# EasyEDA Pro project LogicBoardFPGAEP6.eprj

# Schematic Schematic1
Create Date: 2024-01-02; Page Name: P1; Project Name: LogicBoardFPGAEP6; Schematic Name: Schematic1; Update Date: 2024-01-02; Company: EasyEDA.com; Drawed: EasyEDA Pro; Page Size: A4; Part Number: JLCPCB-002; Reviewed: EasyEDA Pro; Version: V0.1
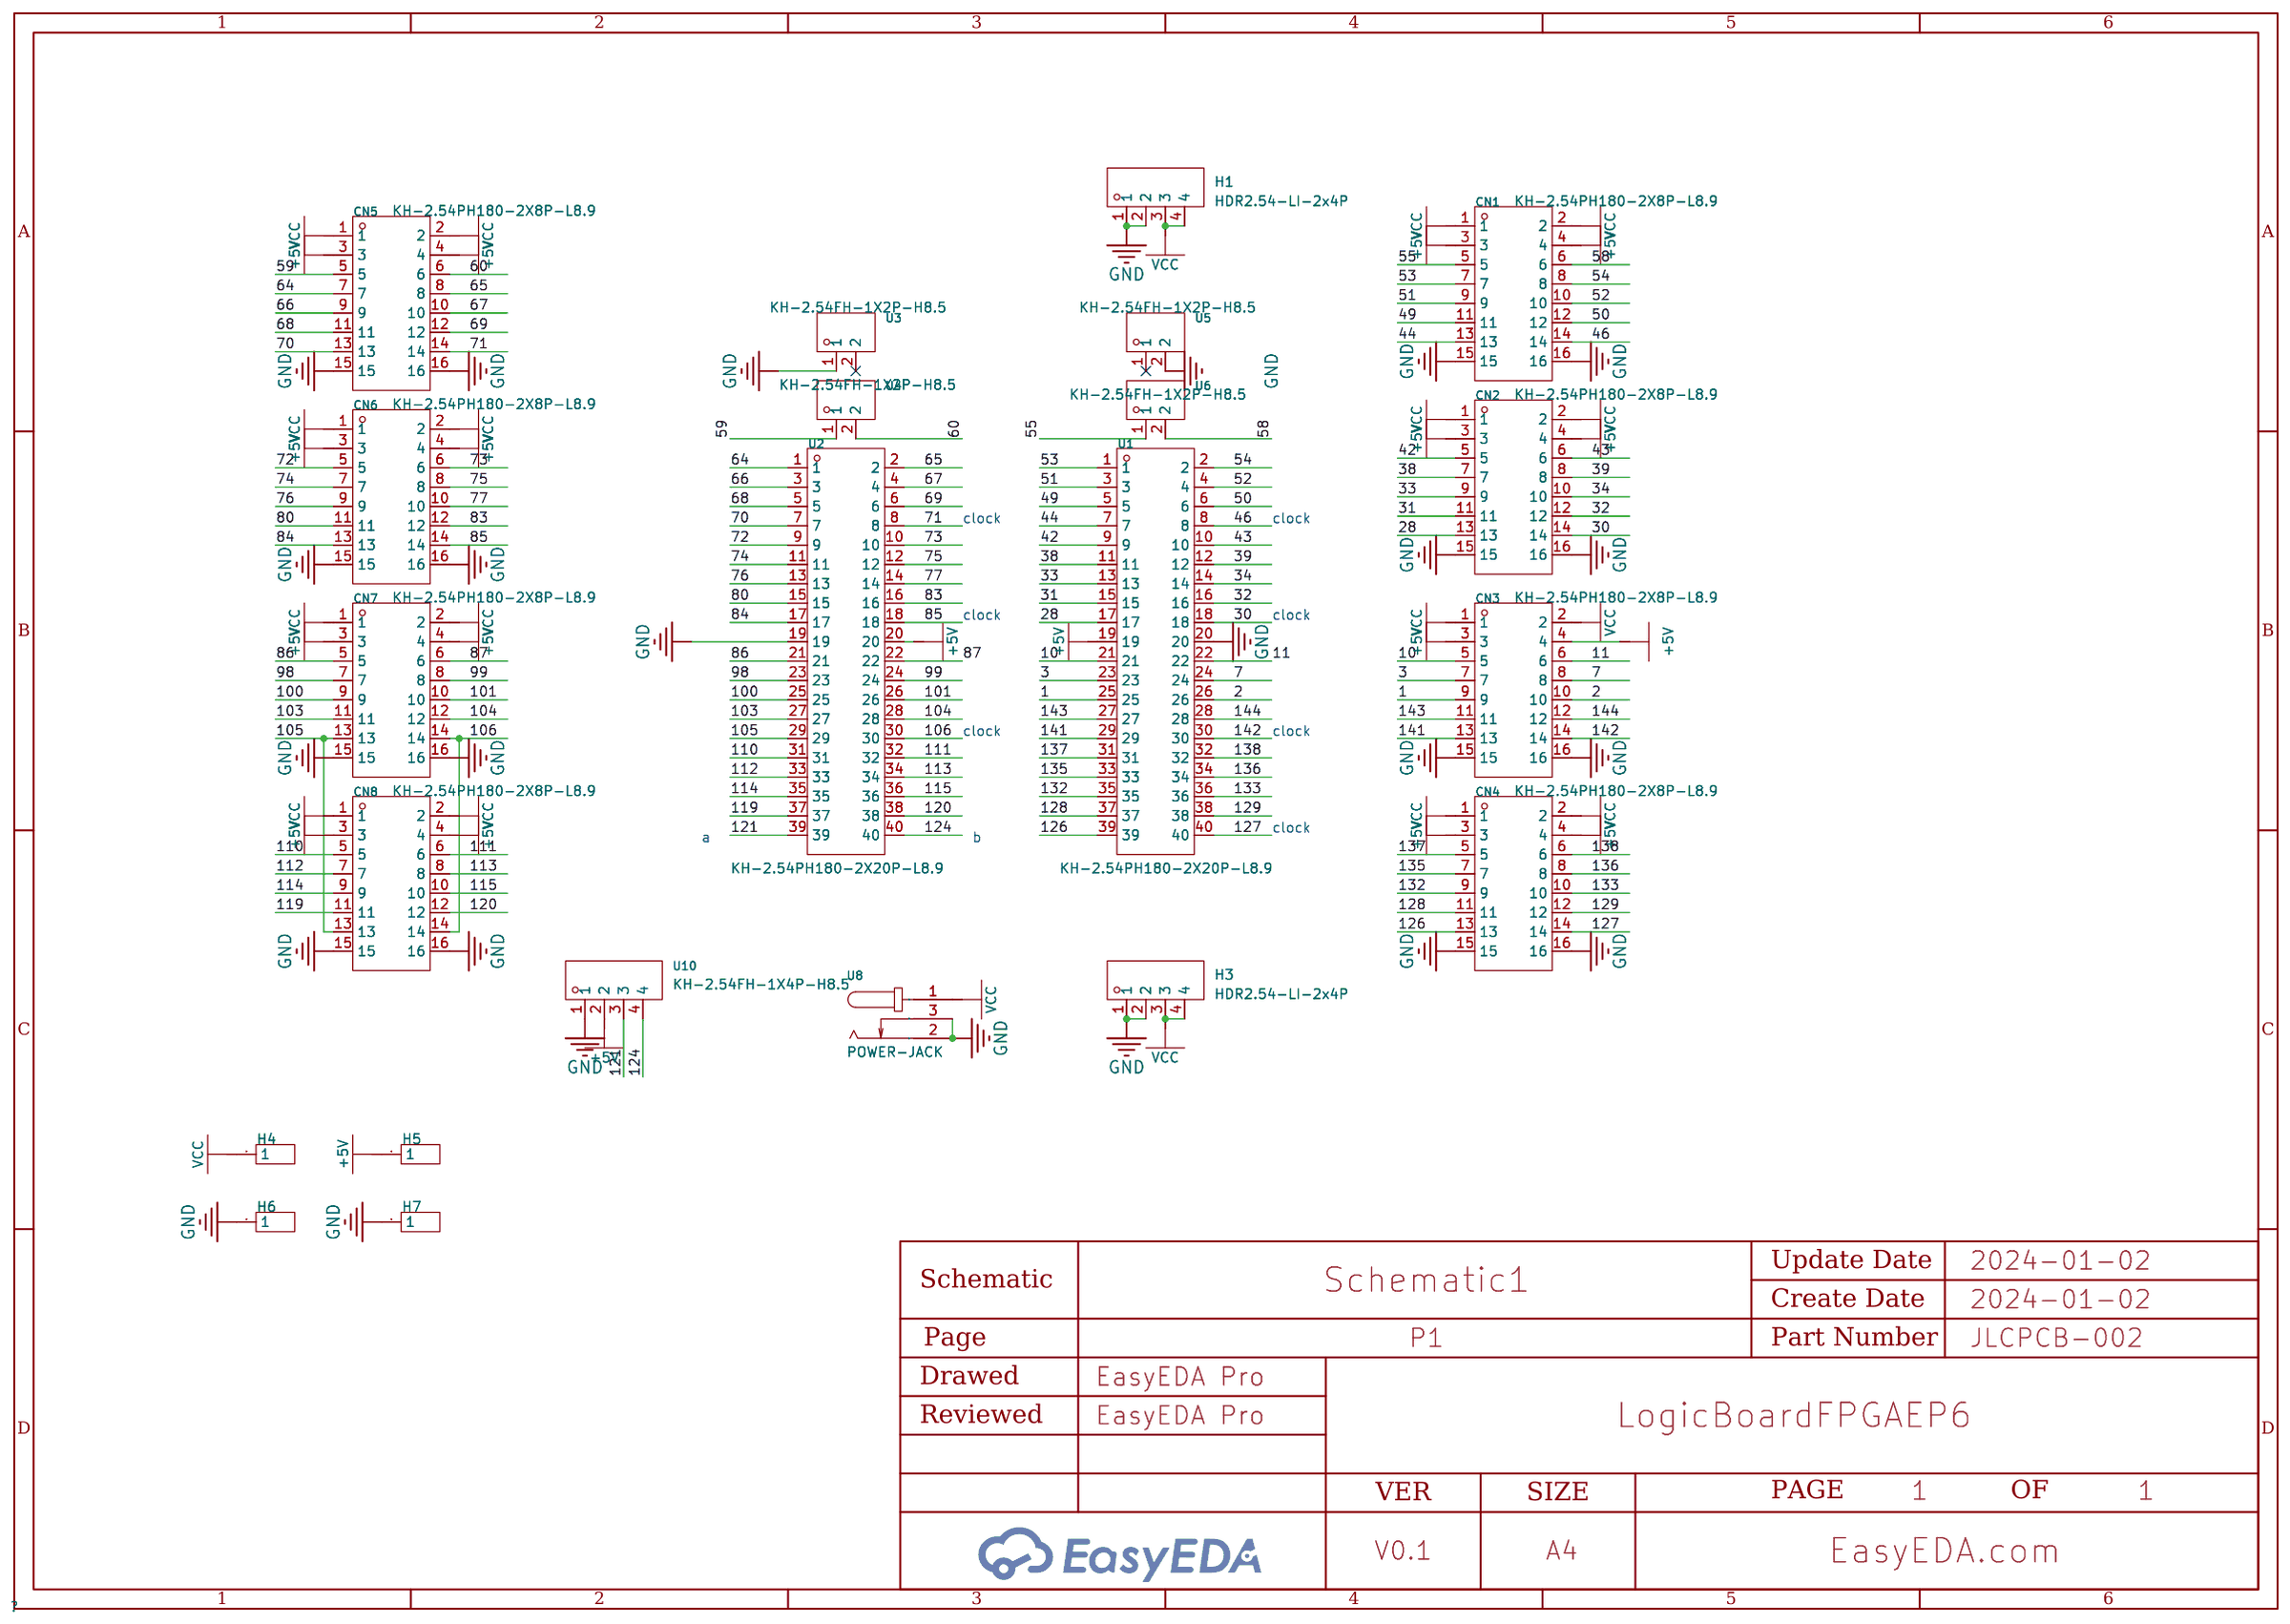
[diagram p0: schematic sheet]

## Parts
CN1  KH-2.54PH180-2X8P-L8.9  [CONN-TH_16P-P2.54_KINGHELM_KH-2.54PH180-2X8P-L8.9]
CN2  KH-2.54PH180-2X8P-L8.9  [CONN-TH_16P-P2.54_KINGHELM_KH-2.54PH180-2X8P-L8.9]
CN3  KH-2.54PH180-2X8P-L8.9  [CONN-TH_16P-P2.54_KINGHELM_KH-2.54PH180-2X8P-L8.9]
CN4  KH-2.54PH180-2X8P-L8.9  [CONN-TH_16P-P2.54_KINGHELM_KH-2.54PH180-2X8P-L8.9]
CN5  KH-2.54PH180-2X8P-L8.9  [CONN-TH_16P-P2.54_KINGHELM_KH-2.54PH180-2X8P-L8.9]
CN6  KH-2.54PH180-2X8P-L8.9  [CONN-TH_16P-P2.54_KINGHELM_KH-2.54PH180-2X8P-L8.9]
CN7  KH-2.54PH180-2X8P-L8.9  [CONN-TH_16P-P2.54_KINGHELM_KH-2.54PH180-2X8P-L8.9]
CN8  KH-2.54PH180-2X8P-L8.9  [CONN-TH_16P-P2.54_KINGHELM_KH-2.54PH180-2X8P-L8.9]
H1  HDR2.54-LI-2x4P  [HDR-TH_4P-P2.54-V-M]
H3  HDR2.54-LI-2x4P  [HDR-TH_4P-P2.54-V-M]
H4  -  [HDR-TH_1P-V-M_XKB_X4611WV-01I-C28D40]
H5  -  [HDR-TH_1P-V-M_XKB_X4611WV-01I-C28D40]
H6  -  [HDR-TH_1P-V-M_XKB_X4611WV-01I-C28D40]
H7  -  [HDR-TH_1P-V-M_XKB_X4611WV-01I-C28D40]
U1  KH-2.54PH180-2X20P-L8.9  [CONN-TH_40P-P2.54_KINGHELM_KH-2.54PH180-2X20P-L8.9]
U2  KH-2.54PH180-2X20P-L8.9  [CONN-TH_40P-P2.54_KINGHELM_KH-2.54PH180-2X20P-L8.9]
U3  KH-2.54FH-1X2P-H8.5  [HDR-TH_2P-P2.54-V-F]
U4  KH-2.54FH-1X2P-H8.5  [HDR-TH_2P-P2.54-V-F]
U5  KH-2.54FH-1X2P-H8.5  [HDR-TH_2P-P2.54-V-F]
U6  KH-2.54FH-1X2P-H8.5  [HDR-TH_2P-P2.54-V-F]
U8  POWER-JACK  [DC-IN-TH_POWER-JACK]
U10  KH-2.54FH-1X4P-H8.5  [HDR-TH_4P-P2.54-V-F]

## Library data of the parts
CN1-CN8 = KH-2.54PH180-2X8P-L8.9: Connector Type:简牛座 Pitch:2.54mm Structure:2x8P Holder Type:Straight Number of Rows:2 Pin Number in each Row:8; LCSC Part Name: 2.54mm 2x8P 排数:2 每排P数:8; Supplier Part: C5157631; Manufacturer: kinghelm(金航标); Supplier Footprint: 插件,P=2.54mm; JLCPCB Part Class: Extended Part; Datasheet: https://atta.szlcsc.com/upload/public/pdf/source/20220902/BDDF6E62C6922AC108506376901906B3.pdf; Supplier: LCSC; Connector Type: 简牛座; Pitch: 2.54mm; Structure: 2x8P; Holder Type: Straight; Number of Rows: 2; Pin Number in each Row: 8
H1 H3 = HDR2.54-LI-2x4P: Supplier Part: C9900020145; JLCPCB Part Class: Extended Part; Supplier: LCSC
H4-H7 = HDR-M_2.54_1x1P: Supplier Footprint: Through
U1 U2 = KH-2.54PH180-2X20P-L8.9: Connector Type:简牛座 Pitch:2.54mm Structure:2x20P Holder Type:Straight Number of Rows:2 Pin Number in each Row:20; LCSC Part Name: 2.54mm 2x20P 排数:2 每排P数:20; Supplier Part: C5157643; Manufacturer: kinghelm(金航标); Supplier Footprint: 插件,P=2.54mm; JLCPCB Part Class: Extended Part; Datasheet: https://atta.szlcsc.com/upload/public/pdf/source/20220902/9F5B5BEF0E6023DA0EFD6D40BEFA82D8.pdf; Supplier: LCSC; Connector Type: 简牛座; Pitch: 2.54mm; Structure: 2x20P; Holder Type: Straight; Number of Rows: 2; Pin Number in each Row: 20
U3-U6 = KH-2.54FH-1X2P-H8.5: Holes Structure:1x2P Pitch:2.54mm Number of Holes:2P Mounting Type:Straight Number of Rows:Plugin Row Spacing:- Circular Hole / Square Hole:Square Holes Current Rating (Max):3A Voltage Rating (Max):- Holes Direction:Top Insulation Height:8.5mm Operating T; LCSC Part Name: 间距:2.54mm 1x2P 直插; Supplier Part: C2905414; Manufacturer: kinghelm(金航标); Supplier Footprint: 插件,P=2.54mm; JLCPCB Part Class: Extended Part; Datasheet: https://atta.szlcsc.com/upload/public/pdf/source/20211019/82C72C7F9B709EC9DF51C3E4488B0388.pdf; Supplier: LCSC; Holes Structure: 1x2P; Pitch: 2.54mm; Number of Holes: 2P; Mounting Type: Straight; Number of Rows: Plugin; Circular Hole / Square Hole: Square Holes; Current Rating (Max): 3A; Holes Direction: Top; Insulation Height: 8.5mm; Operating Temperature Range: -40℃~+105℃
U8 = POWER-JACK: Supplier Part: C9900001795; JLCPCB Part Class: Extended Part; Supplier: LCSC
U10 = KH-2.54FH-1X4P-H8.5: Holes Structure:1x4P Pitch:2.54mm Number of Holes:4P Mounting Type:Straight Number of Rows:Plugin Row Spacing:- Circular Hole / Square Hole:Square Holes Current Rating (Max):3A Voltage Rating (Max):- Holes Direction:Top Insulation Height:8.5mm Operating T; LCSC Part Name: 间距:2.54mm 1x4P 直插; Supplier Part: C2905415; Manufacturer: kinghelm(金航标); Supplier Footprint: 插件,P=2.54mm; JLCPCB Part Class: Extended Part; Datasheet: https://atta.szlcsc.com/upload/public/pdf/source/20211019/F01742C8B89DCA4810A857CC894DA6D1.pdf; Supplier: LCSC; Holes Structure: 1x4P; Pitch: 2.54mm; Number of Holes: 4P; Mounting Type: Straight; Number of Rows: Plugin; Circular Hole / Square Hole: Square Holes; Current Rating (Max): 3A; Holes Direction: Top; Insulation Height: 8.5mm; Operating Temperature Range: -40℃~+105℃

## Nets
+5V: CN1.3 CN1.4 CN2.3 CN2.4 CN3.3 CN3.4 CN4.3 CN4.4 CN5.3 CN5.4 CN6.3 CN6.4 CN7.3 CN7.4 CN8.3 CN8.4 H5.1 U1.19 U2.20 U10.2
GND: CN1.15 CN1.16 CN2.15 CN2.16 CN3.15 CN3.16 CN4.15 CN4.16 CN5.15 CN5.16 CN6.15 CN6.16 CN7.15 CN7.16 CN8.15 CN8.16 H1.1 H1.2 H3.1 H3.2 H6.1 H7.1 U1.20 U2.19 U3.1 U5.2 U8.2 U8.3 U10.1
VCC: CN1.1 CN1.2 CN2.1 CN2.2 CN3.1 CN3.2 CN4.1 CN4.2 CN5.1 CN5.2 CN6.1 CN6.2 CN7.1 CN7.2 CN8.1 CN8.2 H1.3 H1.4 H3.3 H3.4 H4.1 U8.1
1: CN3.9 U1.25
2: CN3.10 U1.26
3: CN3.7 U1.23
7: CN3.8 U1.24
10: CN3.5 U1.21
11: CN3.6 U1.22
28: CN2.13 U1.17
30: CN2.14 U1.18
31: CN2.11 U1.15
32: CN2.12 U1.16
33: CN2.9 U1.13
34: CN2.10 U1.14
38: CN2.7 U1.11
39: CN2.8 U1.12
42: CN2.5 U1.9
43: CN2.6 U1.10
44: CN1.13 U1.7
46: CN1.14 U1.8
49: CN1.11 U1.5
50: CN1.12 U1.6
51: CN1.9 U1.3
52: CN1.10 U1.4
53: CN1.7 U1.1
54: CN1.8 U1.2
55: CN1.5 U6.1
58: CN1.6 U6.2
59: CN5.5 U4.1
60: CN5.6 U4.2
64: CN5.7 U2.1
65: CN5.8 U2.2
66: CN5.9 U2.3
67: CN5.10 U2.4
68: CN5.11 U2.5
69: CN5.12 U2.6
70: CN5.13 U2.7
71: CN5.14 U2.8
72: CN6.5 U2.9
73: CN6.6 U2.10
74: CN6.7 U2.11
75: CN6.8 U2.12
76: CN6.9 U2.13
77: CN6.10 U2.14
80: CN6.11 U2.15
83: CN6.12 U2.16
84: CN6.13 U2.17
85: CN6.14 U2.18
86: CN7.5 U2.21
87: CN7.6 U2.22
98: CN7.7 U2.23
99: CN7.8 U2.24
100: CN7.9 U2.25
101: CN7.10 U2.26
103: CN7.11 U2.27
104: CN7.12 U2.28
105: CN7.13 CN8.13 U2.29
106: CN7.14 CN8.14 U2.30
110: CN8.5 U2.31
111: CN8.6 U2.32
112: CN8.7 U2.33
113: CN8.8 U2.34
114: CN8.9 U2.35
115: CN8.10 U2.36
119: CN8.11 U2.37
120: CN8.12 U2.38
121: U2.39 U10.3
124: U2.40 U10.4
126: CN4.13 U1.39
127: CN4.14 U1.40
128: CN4.11 U1.37
129: CN4.12 U1.38
132: CN4.9 U1.35
133: CN4.10 U1.36
135: CN4.7 U1.33
136: CN4.8 U1.34
137: CN4.5 U1.31
138: CN4.6 U1.32
141: CN3.13 U1.29
142: CN3.14 U1.30
143: CN3.11 U1.27
144: CN3.12 U1.28

Not connected (* = marked no-connect by the designer): U3 2*; U5 1*

## Notes on the sheet
- clock
- clock
- clock
- clock
- clock
- clock
- a
- b
- clock

# Board PCB1
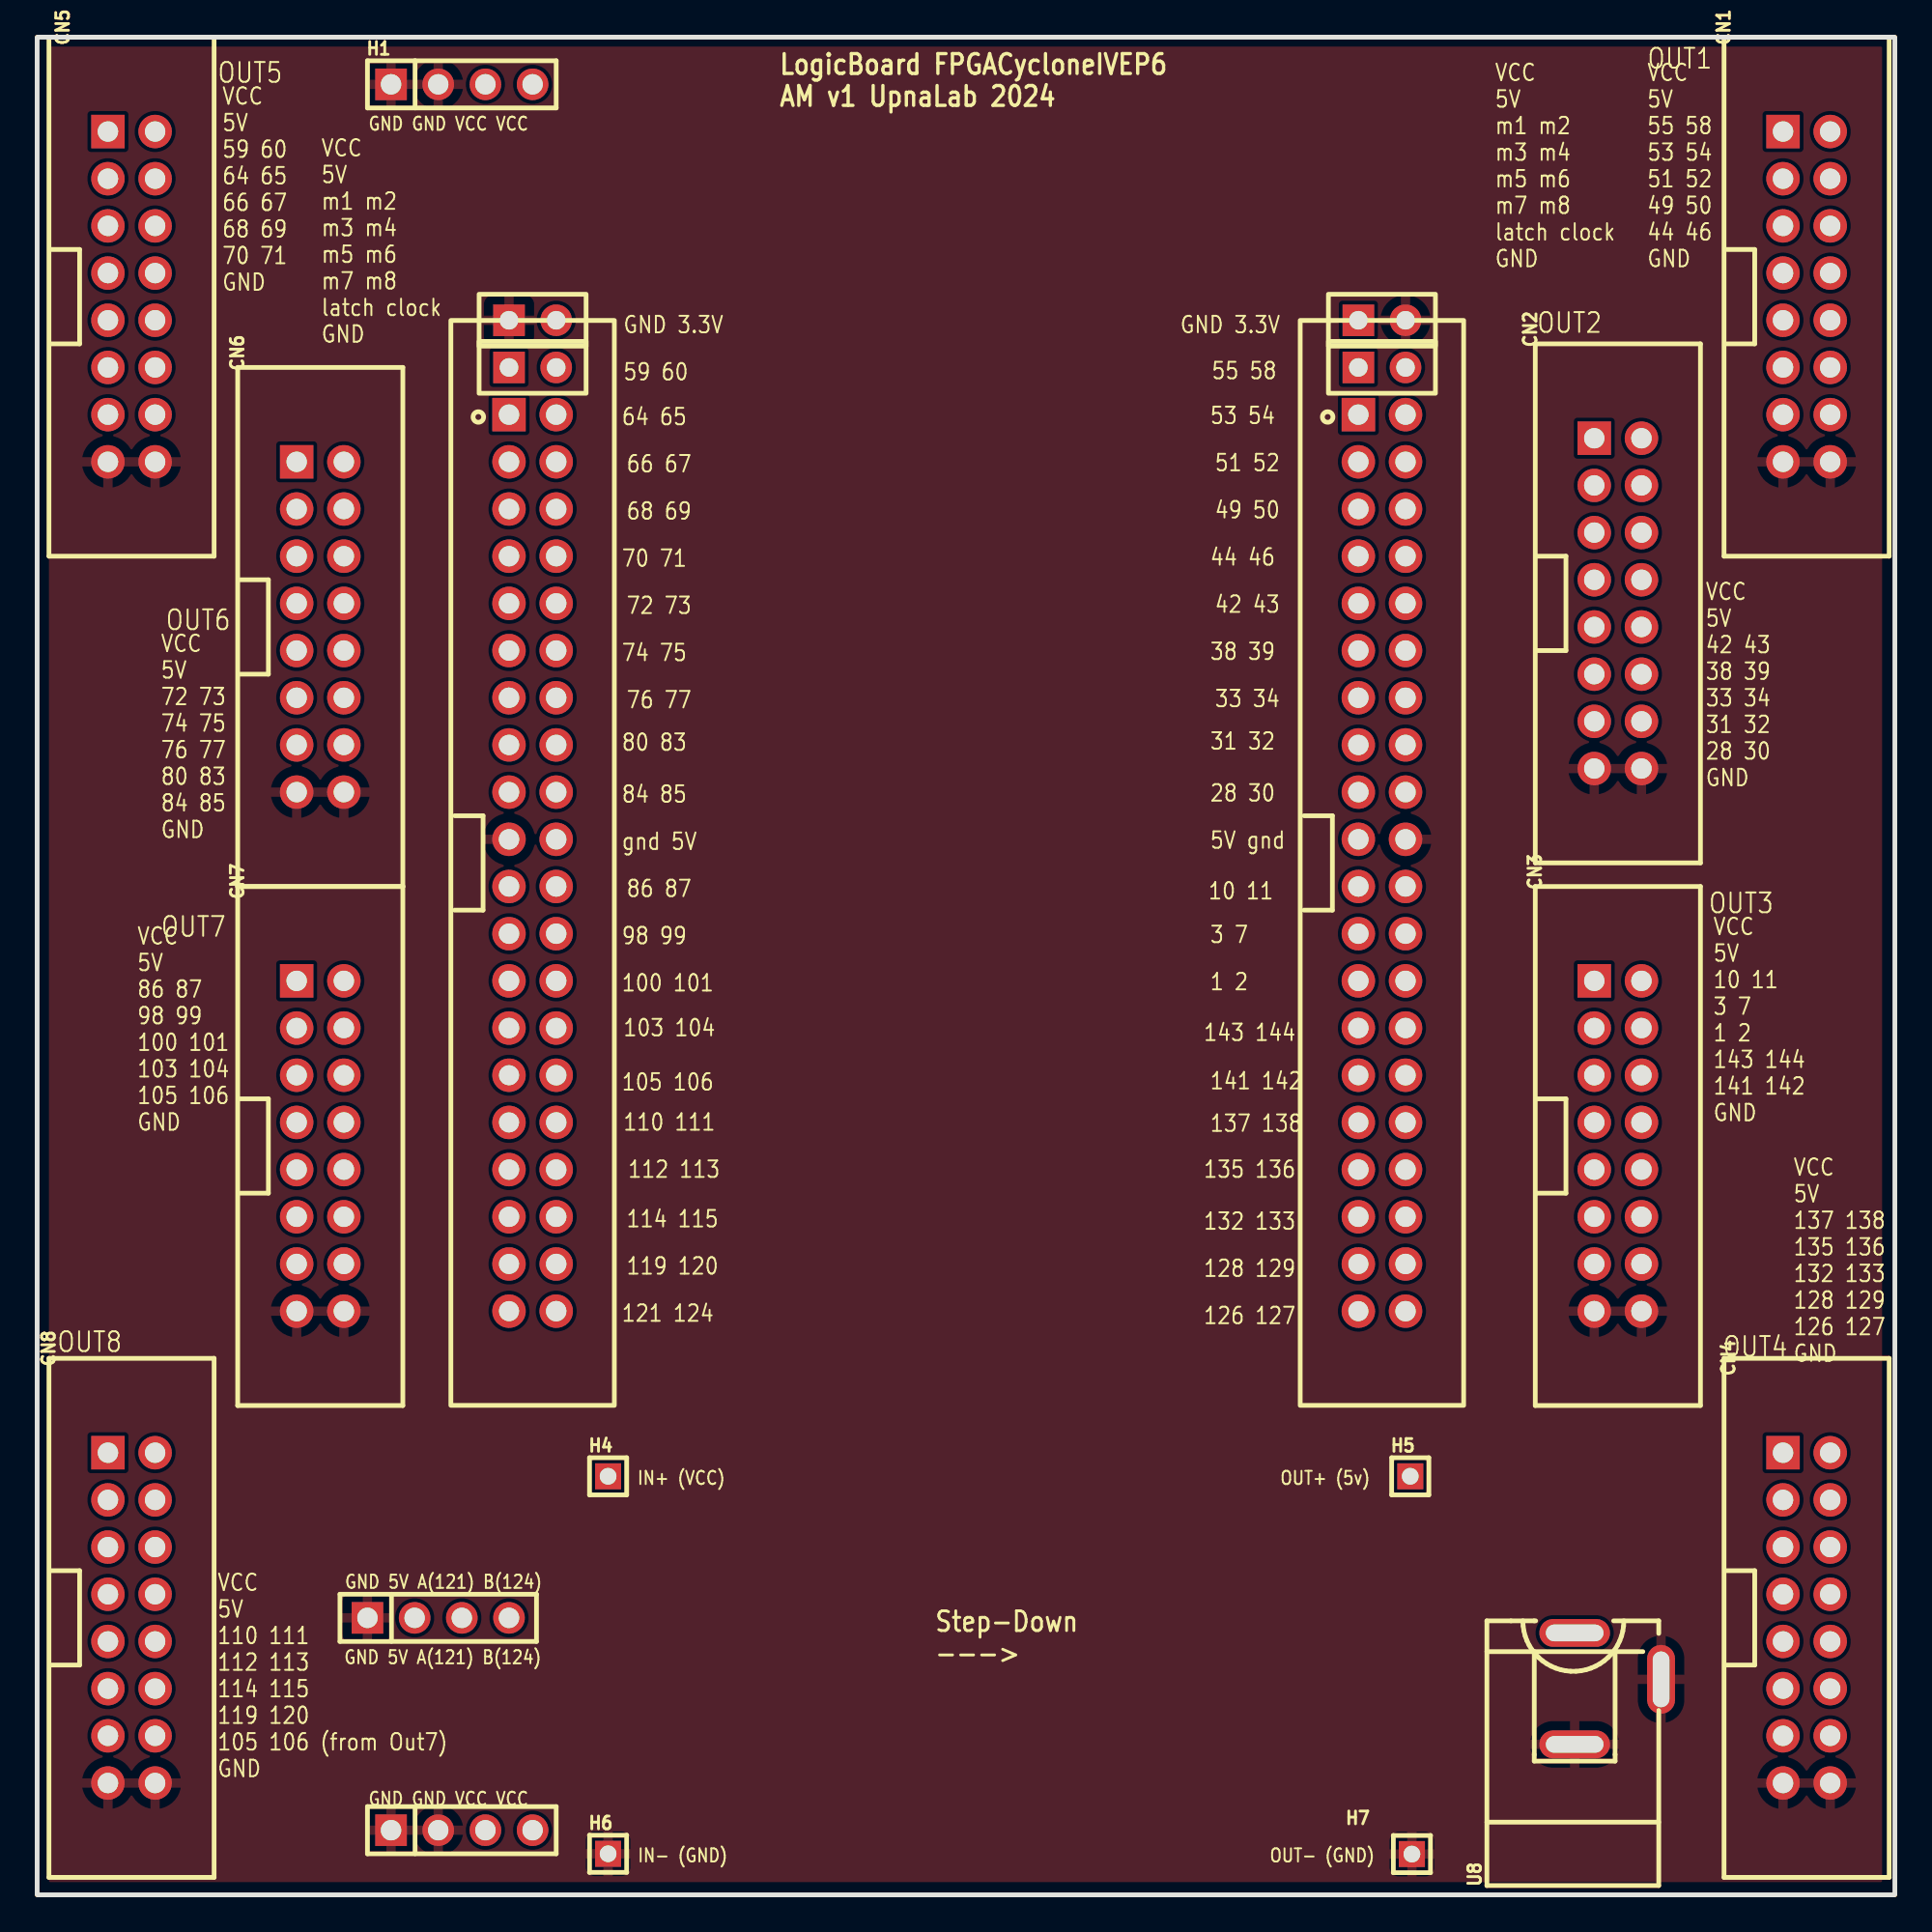
[diagram p1: board, top side]
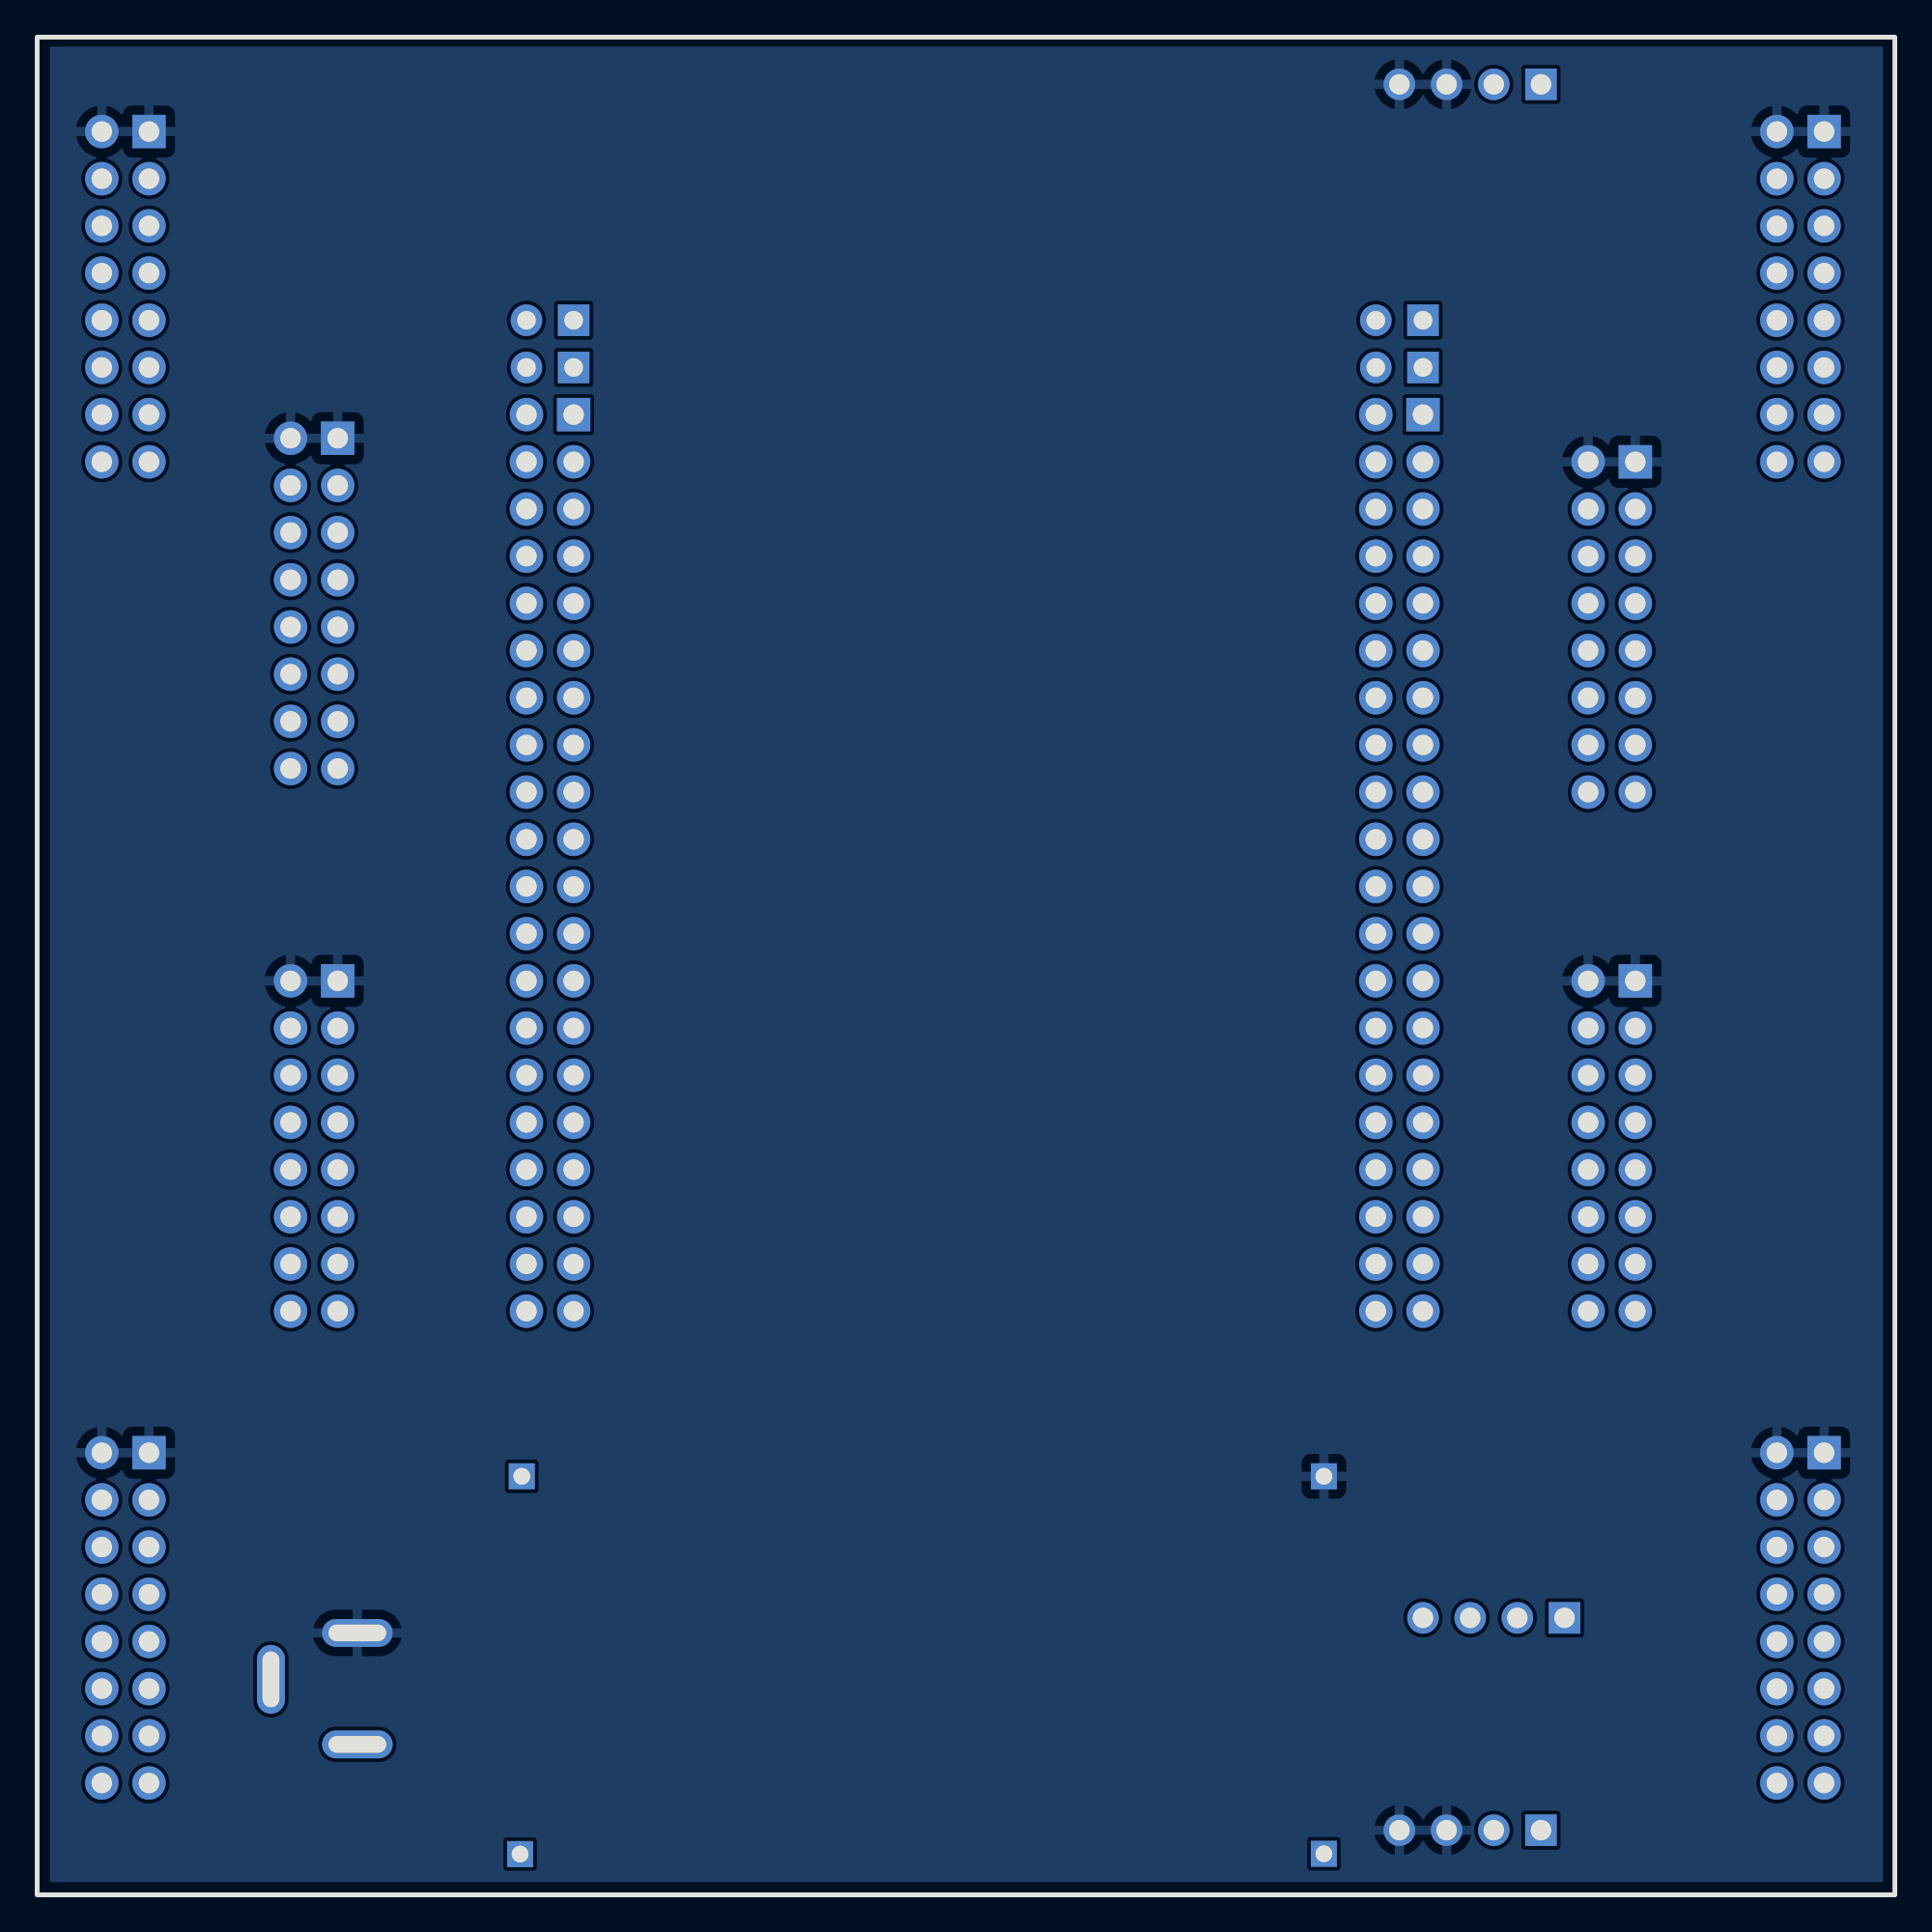
[diagram p2: board, bottom side, seen from below]

Outline 100 x 100 mm; copper layers: Top Layer, Inner1, Inner2, Bottom Layer. Coordinates in mm from the lower left corner of the outline.
Outline path: rectangle 0,100 100,0
Stack: Top Layer 0.035mm 外层铜厚1oz / Dielectric1 0.2104mm 7628 RC49% 8.6mil / Inner1 0.0152mm 内层铜厚 / Dielectric2 1.065mm 1.1mm H/HOZ 含铜 / Inner2 0.0152mm 内层铜厚 / Dielectric3 0.2104mm 7628 RC49% 8.6mil / Bottom Layer 0.035mm 外层铜厚1oz

## Design rules (mm)
template: JLCPCB Capability(Two Layers Board)
spacing copperThickness1oz (default): track to track 0.102, other pairs 0.152 to 0.3
spacing copperThickness2oz: track to track 0.203, other pairs 0.152 to 0.3
track width copperThickness1oz (default): min 0.127, default 0.254, max 2.54
track width copperThickness2oz: min 0.203, default 0.254, max 2.54
differential pair differentialPair (default): width min 0.127, default 0.254, max 2.54; gap min 0.152, default 0.152
via viaSize (default): diameter min 0.5, default 0.61, max 10; hole min 0.3, default 0.305, max 6.3

## Placement (name value [footprint] x y rotation side)
CN1  KH-2.54PH180-2X8P-L8.9  [conn-th_16p-p2.54_kinghelm_kh-2.54ph180-2x8p-l8.9]  95.25 86.03 270 top
CN2  KH-2.54PH180-2X8P-L8.9  [conn-th_16p-p2.54_kinghelm_kh-2.54ph180-2x8p-l8.9]  85.09 69.52 270 top
CN3  KH-2.54PH180-2X8P-L8.9  [conn-th_16p-p2.54_kinghelm_kh-2.54ph180-2x8p-l8.9]  85.09 40.31 270 top
CN4  KH-2.54PH180-2X8P-L8.9  [conn-th_16p-p2.54_kinghelm_kh-2.54ph180-2x8p-l8.9]  95.25 14.91 270 top
CN5  KH-2.54PH180-2X8P-L8.9  [conn-th_16p-p2.54_kinghelm_kh-2.54ph180-2x8p-l8.9]  5.08 86.03 270 top
CN6  KH-2.54PH180-2X8P-L8.9  [conn-th_16p-p2.54_kinghelm_kh-2.54ph180-2x8p-l8.9]  15.24 68.25 270 top
CN7  KH-2.54PH180-2X8P-L8.9  [CONN-TH_16P-P2.54_KINGHELM_KH-2.54PH180-2X8P-L8.9]  15.24 40.31 270 top
CN8  KH-2.54PH180-2X8P-L8.9  [conn-th_16p-p2.54_kinghelm_kh-2.54ph180-2x8p-l8.9]  5.08 14.91 270 top
H1  HDR2.54-LI-2x4P  [hdr-th_4p-p2.54-v-m]  22.86 97.46 0 top
H3  HDR2.54-LI-2x4P  [hdr-th_4p-p2.54-v-m]  22.86 3.48 0 top
H4  -  [hdr-th_1p-v-m_xkb_x4611wv-01i-c28d40]  30.73 22.53 0 top
H5  -  [hdr-th_1p-v-m_xkb_x4611wv-01i-c28d40]  73.91 22.53 0 top
H6  -  [hdr-th_1p-v-m_xkb_x4611wv-01i-c28d40]  30.73 2.21 0 top
H7  -  [hdr-th_1p-v-m_xkb_x4611wv-01i-c28d40]  74 2.19 0 top
U1  KH-2.54PH180-2X20P-L8.9  [CONN-TH_40P-P2.54_KINGHELM_KH-2.54PH180-2X20P-L8.9]  72.39 55.55 270 top
U2  KH-2.54PH180-2X20P-L8.9  [CONN-TH_40P-P2.54_KINGHELM_KH-2.54PH180-2X20P-L8.9]  26.67 55.55 270 top
U3  KH-2.54FH-1X2P-H8.5  [HDR-TH_2P-P2.54-V-F]  26.67 84.76 0 top
U4  KH-2.54FH-1X2P-H8.5  [HDR-TH_2P-P2.54-V-F]  26.67 82.22 0 top
U5  KH-2.54FH-1X2P-H8.5  [HDR-TH_2P-P2.54-V-F]  72.39 84.76 0 top
U6  KH-2.54FH-1X2P-H8.5  [HDR-TH_2P-P2.54-V-F]  72.39 82.22 0 top
U8  POWER-JACK  [dc-in-th_power-jack]  85.09 11.1 90 top
U10  KH-2.54FH-1X4P-H8.5  [HDR-TH_4P-P2.54-V-F]  21.59 14.91 0 top

## Footprints (pads in the part's own frame, mm; a bottom-side part is the same pattern mirrored in y, then rotated)
conn-th_16p-p2.54_kinghelm_kh-2.54ph180-2x8p-l8.9
  rect 1.8x1.8 hole 1.1: 1(-8.89,-1.27)
  round 1.8 hole 1.1: 2(-8.89,1.27) 3(-6.35,-1.27) 4(-6.35,1.27) 5(-3.81,-1.27) 6(-3.81,1.27) 7(-1.27,-1.27) 8(-1.27,1.27) 9(1.27,-1.27) 10(1.27,1.27) 11(3.81,-1.27) 12(3.81,1.27) 13(6.35,-1.27) 14(6.35,1.27) 15(8.89,-1.27) 16(8.89,1.27)
CONN-TH_16P-P2.54_KINGHELM_KH-2.54PH180-2X8P-L8.9
  rect 1.8x1.8 hole 1.1: 1(-8.89,-1.27)
  round 1.8 hole 1.1: 2(-8.89,1.27) 3(-6.35,-1.27) 4(-6.35,1.27) 5(-3.81,-1.27) 6(-3.81,1.27) 7(-1.27,-1.27) 8(-1.27,1.27) 9(1.27,-1.27) 10(1.27,1.27) 11(3.81,-1.27) 12(3.81,1.27) 13(6.35,-1.27) 14(6.35,1.27) 15(8.89,-1.27) 16(8.89,1.27)
CONN-TH_40P-P2.54_KINGHELM_KH-2.54PH180-2X20P-L8.9
  rect 1.8x1.8 hole 1.1: 1(-24.13,-1.27)
  round 1.8 hole 1.1: 2(-24.13,1.27) 3(-21.59,-1.27) 4(-21.59,1.27) 5(-19.05,-1.27) 6(-19.05,1.27) 7(-16.51,-1.27) 8(-16.51,1.27) 9(-13.97,-1.27) 10(-13.97,1.27) 11(-11.43,-1.27) 12(-11.43,1.27) 13(-8.89,-1.27) 14(-8.89,1.27) 15(-6.35,-1.27) 16(-6.35,1.27) 17(-3.81,-1.27) 18(-3.81,1.27) 19(-1.27,-1.27) 20(-1.27,1.27) 21(1.27,-1.27) 22(1.27,1.27) 23(3.81,-1.27) 24(3.81,1.27) 25(6.35,-1.27) 26(6.35,1.27) 27(8.89,-1.27) 28(8.89,1.27) 30(11.43,1.27) 32(13.97,1.27) 33(16.51,-1.27) 34(16.51,1.27) 35(19.05,-1.27) 36(19.05,1.27) 38(21.59,1.27) 40(24.13,1.27)
  round 1.8 hole 1.082: 29(11.43,-1.27) 31(13.97,-1.27) 37(21.59,-1.27) 39(24.13,-1.27)
dc-in-th_power-jack
  oval 1.5x3.8 hole 0.9x3.1: 1(2.999,2.325) 2(-2.999,2.325)
  oval 3.7x1.5 hole 3x0.9: 3(0.5,-2.325)
hdr-th_1p-v-m_xkb_x4611wv-01i-c28d40
  rect 1.4x1.4 hole 0.9: 1(0,0)
HDR-TH_2P-P2.54-V-F
  rect 1.7x1.7 hole 1: 1(-1.27,0)
  round 1.7 hole 1: 2(1.27,0)
HDR-TH_4P-P2.54-V-F
  rect 1.7x1.7 hole 1.1: 1(-3.81,0)
  round 1.7 hole 1.1: 2(-1.27,0) 3(1.27,0) 4(3.81,0)
hdr-th_4p-p2.54-v-m
  rect 1.7x1.7 hole 1.1: 1(-3.81,0)
  round 1.7 hole 1.1: 2(-1.27,0) 3(1.27,0) 4(3.81,0)

## Nets
As in the schematic.

Pads without a net: U3 2; U5 1

## Routing (per net, layer and track width the routed paths; a pad name or vN(x,y) marks a point on that pad's centre or on a via; arc(x,y) is an arc through that point)
1: length 18.5
  Inner1 w0.254: U1.25 72.39,47.93 76.96,47.93 78.23,46.66 78.23,43.87 83.06,39.04 CN3.9
2: length 19
  Inner1 w0.254: CN3.10 85.09,40.31 82.8,40.31 78.74,44.37 78.74,47.93 77.47,49.2 U1.26
3: length 19.6
  Inner1 w0.254: CN3.7 82.55,41.58 79.5,44.63 79.5,49.2 78.23,50.47 72.39,50.47 U1.23
7: length 19.9
  Inner1 w0.254: U1.24 78.74,51.74 80.26,50.22 80.26,45.14 82.55,42.85 85.09,42.85 CN3.8
10: length 20.5
  Inner1 w0.254: CN3.5 82.3,44.12 81.28,45.14 81.28,51.23 79.5,53.01 72.39,53.01 U1.21
11: length 20
  Inner1 w0.254: U1.22 79.25,54.28 82.04,51.49 82.04,46.15 82.8,45.39 85.09,45.39 CN3.6
28: length 14.3
  Inner1 w0.254: CN2.13 81.03,63.17 78.49,60.63 72.39,60.63 U1.17
30: length 14.3
  Inner1 w0.254: CN2.14 85.09,61.9 82.04,61.9 79.5,59.36 U1.18
31: length 14.3
  Inner1 w0.254: U1.15 72.39,63.17 76.71,63.17 79.25,65.71 CN2.11
32: length 14.3
  Inner1 w0.254: U1.16 77.47,61.9 80.01,64.44 85.09,64.44 CN2.12
33: length 14.3
  Inner1 w0.254: CN2.9 78.23,68.25 75.69,65.71 72.39,65.71 U1.13
34: length 14.3
  Inner1 w0.254: U1.14 76.2,64.44 78.74,66.98 85.09,66.98 CN2.10
38: length 14.3
  Inner1 w0.254: CN2.7 77.72,70.79 75.18,68.25 72.39,68.25 U1.11
39: length 14.3
  Inner1 w0.254: CN2.8 85.09,69.52 78.23,69.52 75.69,66.98 U1.12
42: length 14.3
  Inner1 w0.254: U1.9 72.39,70.79 75.18,70.79 77.72,73.33 CN2.5
43: length 14.3
  Inner1 w0.254: U1.10 75.18,69.52 77.72,72.06 85.09,72.06 CN2.6
44: length 27.1
  Inner1 w0.254: CN1.13 92.95,79.68 91.68,80.95 82.3,80.95 74.68,73.33 72.39,73.33 U1.7
46: length 27.5
  Inner1 w0.254: U1.8 74.68,72.06 82.8,80.19 91.44,80.19 93.22,78.41 95.25,78.41 CN1.14
49: length 26.2
  Inner1 w0.254: U1.5 72.39,75.87 74.42,75.87 81.03,82.47 93.73,82.47 CN1.11
50: length 26.6
  Inner1 w0.254: CN1.12 95.25,80.95 92.71,80.95 91.95,81.71 81.79,81.71 74.68,74.6 U1.6
51: length 26
  Inner1 w0.254: U1.3 72.39,78.41 74.42,78.41 80.01,84 90.68,84 91.44,84.76 CN1.9
52: length 26
  Inner1 w0.254: CN1.10 95.25,83.49 91.69,83.49 91.44,83.24 80.26,83.24 74.17,77.14 U1.4
53: length 26
  Inner1 w0.254: U1.1 72.39,80.95 74.42,80.95 79.25,85.78 89.92,85.78 91.44,87.3 CN1.7
54: length 26
  Inner1 w0.254: U1.2 74.17,79.68 79.25,84.76 90.17,84.76 91.44,86.03 95.25,86.03 CN1.8
55: length 26
  Inner1 w0.254: U6.1 72.39,83.49 74.42,83.49 78.74,87.81 89.92,87.81 91.95,89.84 CN1.5
58: length 26
  Inner1 w0.254: U6.2 74.17,82.22 78.74,86.79 89.66,86.79 91.44,88.57 95.25,88.57 CN1.6
59: length 24.7
  Inner1 w0.254: U4.1 19.05,88.57 5.08,88.57 CN5.5
60: length 26.4
  Inner1 w0.254: U4.2 26.67,83.49 26.67,86.28 23.11,89.84 CN5.6
64: length 24.7
  Inner1 w0.254: CN5.7 5.08,86.03 17.78,86.03 24.13,79.68 U2.1
65: length 24.7
  Inner1 w0.254: CN5.8 18.03,87.3 24.38,80.95 26.67,80.95 U2.2
66: length 24.7
  Inner1 w0.254: CN5.9 5.08,83.49 17.78,83.49 24.13,77.14 U2.3
67: length 24.7
  Inner1 w0.254: CN5.10 17.78,84.76 24.13,78.41 26.67,78.41 U2.4
68: length 24.7
  Inner1 w0.254: CN5.11 5.08,80.95 17.78,80.95 24.13,74.6 U2.5
69: length 24.9
  Inner1 w0.254: CN5.12 17.78,82.22 24.13,75.87 26.92,75.87 27.94,74.85 U2.6
70: length 24.7
  Inner1 w0.254: U2.7 23.88,72.06 17.44,78.5 4.99,78.5 CN5.13
71: length 24.7
  Inner1 w0.254: CN5.14 17.53,79.68 23.88,73.33 26.67,73.33 U2.8
72: length 12.5
  Inner1 w0.254: U2.9 23.37,69.52 22.1,70.79 15.24,70.79 CN6.5
73: length 12.5
  Inner1 w0.254: CN6.6 22.61,72.06 23.88,70.79 26.67,70.79 U2.10
74: length 12.5
  Inner1 w0.254: CN6.7 15.24,68.25 21.84,68.25 23.11,66.98 U2.11
75: length 12.5
  Inner1 w0.254: CN6.8 22.1,69.52 23.37,68.25 26.67,68.25 U2.12
76: length 12.5
  Inner1 w0.254: U2.13 23.37,64.44 22.1,65.71 15.24,65.71 CN6.9
77: length 12.5
  Inner1 w0.254: U2.14 26.67,65.71 23.37,65.71 22.1,66.98 CN6.10
80: length 12.5
  Inner1 w0.254: CN6.11 15.24,63.17 22.1,63.17 23.37,61.9 U2.15
83: length 12.6
  Inner1 w0.254: CN6.12 22.1,64.44 23.37,63.17 26.92,63.17 27.94,62.15 U2.16
84: length 12.5
  Inner1 w0.254: CN6.13 15.24,60.63 21.08,60.63 22.35,59.36 U2.17
85: length 12.5
  Inner1 w0.254: U2.18 26.67,60.63 23.11,60.63 21.84,61.9 CN6.14
86: length 16.8
  Inner1 w0.254: CN7.5 13.97,44.37 14.99,45.39 17.02,45.39 18.54,46.91 18.54,48.69 24.13,54.28 U2.21
87: length 16.1
  Inner1 w0.254: U2.22 27.94,54.03 26.92,53.01 24.89,53.01 24.13,52.25 24.13,51.74 CN7.6
98: length 16.2
  Inner1 w0.254: CN7.7 15.24,42.85 17.27,42.85 18.29,43.87 18.29,44.88 25.15,51.74 U2.23
99: length 16.1
  Inner1 w0.254: CN7.8 16.76,41.58 19.05,43.87 19.05,44.63 24.89,50.47 26.67,50.47 U2.24
100: length 16.2
  Inner1 w0.254: U2.25 24.89,49.2 18.03,42.34 18.03,41.33 17.02,40.31 15.24,40.31 CN7.9
101: length 16.1
  Inner1 w0.254: CN7.10 24.13,46.66 24.13,47.42 24.64,47.93 26.67,47.93 U2.26
103: length 16.2
  Inner1 w0.254: U2.27 25.15,46.66 17.78,39.29 17.78,38.28 17.27,37.77 15.24,37.77 CN7.11
104: length 16.4
  Inner1 w0.254: U2.28 26.67,45.39 24.64,45.39 23.88,44.63 23.88,43.36 17.02,36.5 CN7.12
105: length 51.4
  Inner1 w0.254: U2.29 18.03,36.75 18.03,35.99 17.27,35.23 15.24,35.23 CN7.13
  Inner2 w0.254: CN8.13 2.54,8.56 1.27,9.83 1.27,26.09 9.14,33.96 CN7.13
106: length 54.5
  Inner1 w0.254: U2.30 26.67,42.85 25,42.85 18.64,36.49 18.64,35.59 17.02,33.96 CN7.14
  Inner2 w0.254: CN7.14 15.24,32.69 9.14,32.69 1.78,25.32 1.78,10.85 2.79,9.83 5.08,9.83 CN8.14
110: length 34
  Inner1 w0.254: U2.31 24.89,41.58 19.3,35.99 19.3,31.17 13.46,25.32 12.19,25.32 6.86,19.99 4.83,19.99 3.81,18.97 CN8.5
111: length 34.5
  Inner1 w0.254: CN8.6 8.89,18.72 20.07,29.9 20.07,35.74 24.64,40.31 26.67,40.31 U2.32
112: length 35.2
  Inner1 w0.254: U2.33 24.13,39.04 20.57,35.48 20.57,28.37 9.65,17.45 5.08,17.45 CN8.7
113: length 35.8
  Inner1 w0.254: CN8.8 10.16,16.18 21.34,27.36 21.34,35.48 23.62,37.77 26.67,37.77 U2.34
114: length 36.1
  Inner1 w0.254: U2.35 23.37,36.5 22.1,35.23 22.1,26.59 10.41,14.91 5.08,14.91 CN8.9
115: length 36.3
  Inner1 w0.254: CN8.10 6.6,13.39 10.41,13.39 22.86,25.83 22.86,34.47 23.62,35.23 26.67,35.23 U2.36
119: length 36
  Inner1 w0.254: U2.37 23.88,33.96 23.37,33.45 23.37,25.07 10.67,12.37 5.08,12.37 CN8.11
120: length 35.7
  Inner1 w0.254: U2.38 26.67,32.69 24.64,32.69 24.13,32.18 24.13,24.31 10.92,11.1 CN8.12
121: length 17.6
  Inner1 w0.254: U10.3 25.4,17.45 U2.39
124: length 17.6
  Inner1 w0.254: U10.4 27.94,17.45 U2.40
126: length 32.9
  Inner1 w0.254: U1.39 71.12,30.45 93.01,8.56 CN4.13
127: length 33.5
  Inner1 w0.254: CN4.14 95.25,9.83 93.22,9.83 73.66,29.39 U1.40
128: length 34.3
  Inner1 w0.254: CN4.11 92.96,11.1 75.18,28.88 75.18,32.18 74.68,32.69 72.39,32.69 U1.37
129: length 35
  Inner1 w0.254: CN4.12 95.25,12.37 92.71,12.37 75.95,29.13 75.95,33.71 75.69,33.96 U1.38
132: length 35.2
  Inner1 w0.254: CN4.9 92.71,13.64 76.71,29.64 76.71,34.47 75.95,35.23 72.39,35.23 U1.35
133: length 35.5
  Inner1 w0.254: CN4.10 95.25,14.91 92.46,14.91 77.72,29.64 77.72,34.98 76.2,36.5 U1.36
135: length 35.6
  Inner1 w0.254: U1.33 72.39,37.77 76.2,37.77 78.49,35.48 78.49,29.9 92.2,16.18 CN4.7
136: length 35.5
  Inner1 w0.254: CN4.8 95.25,17.45 92.2,17.45 79.25,30.4 79.25,35.74 75.95,39.04 U1.34
137: length 35.6
  Inner1 w0.254: CN4.5 91.95,18.72 80.01,30.66 80.01,36.25 75.95,40.31 72.39,40.31 U1.31
138: length 35.5
  Inner1 w0.254: U1.32 75.69,41.58 80.77,36.5 80.77,31.17 91.95,19.99 95.25,19.99 CN4.6
141: length 17.7
  Inner1 w0.254: U1.29 72.39,42.85 75.44,42.85 81.53,36.75 81.53,35.48 83.06,33.96 CN3.13
142: length 17.7
  Inner1 w0.254: U1.30 75.18,44.12 82.04,37.26 82.04,35.99 82.8,35.23 85.09,35.23 CN3.14
143: length 17.4
  Inner1 w0.254: U1.27 72.39,45.39 75.69,45.39 76.45,44.63 76.45,43.87 CN3.11
144: length 17.9
  Inner1 w0.254: U1.28 76.2,46.66 77.47,45.39 77.47,43.61 83.31,37.77 85.09,37.77 CN3.12

## Copper pours and planes (outline as drawn; the poured copper is in the pictures)
+5V on Inner1: 0.68,99.62 99.31,99.62 99.31,0.94 0.68,0.94
+5V on Inner2: 0.64,99.39 99.31,99.39 99.31,0.69 0.64,0.69
GND on Top Layer: 0.64,99.49 99.31,99.49 99.31,0.69 0.64,0.69
VCC on Bottom Layer: 0.64,99.49 99.31,99.49 99.31,0.69 0.64,0.69

## Text on the board
Top Silkscreen Layer: GND 5V A(121) B(124) | GND GND VCC VCC | IN+ (VCC) | IN- (GND) | OUT- (GND) | OUT+ (5v) | VCC / 5V / 86 87 / 98 99 / 100 101 / 103 104 / 105 106 / GND | VCC / 5V / 72 73 / 74 75 / 76 77 / 80 83 / 84 85 / GND | VCC / 5V / 110 111 / 112 113 / 114 115 / 119 120 / 105 106 (from Out7) / GND | VCC / 5V / 59 60 / 64 65 / 66 67 / 68 69 / 70 71 / GND | VCC / 5V / m1 m2 / m3 m4 / m5 m6 / m7 m8 / latch clock / GND | 64 65 | 70 71 | 74 75 | 80 83 | 84 85 | gnd 5V | 98 99 | 100 101 | 105 106 | 121 124 | GND 3.3V | 59 60 | 103 104 | 110 111 | 66 67 | 68 69 | 72 73 | 76 77 | 86 87 | 114 115 | 119 120 | 112 113 | 143 144 | 135 136 | 132 133 | 128 129 | 126 127 | 10 11 | 53 54 | 44 46 | 38 39 | 31 32 | 28 30 | 5V gnd | 3 7 | 1 2 | 141 142 | 137 138 | 55 58 | 51 52 | 49 50 | 42 43 | 33 34 | VCC / 5V / 55 58 / 53 54 / 51 52 / 49 50 / 44 46 / GND | VCC / 5V / 42 43 / 38 39 / 33 34 / 31 32 / 28 30 / GND | VCC / 5V / 10 11 / 3 7 / 1 2 / 143 144 / 141 142 / GND | VCC / 5V / 137 138 / 135 136 / 132 133 / 128 129 / 126 127 / GND | OUT6 | OUT5 | OUT2 | OUT1 | OUT3 | OUT4 | OUT8 | OUT7 | Step-Down / ---> | LogicBoard FPGACycloneIVEP6 / AM v1 UpnaLab 2024
